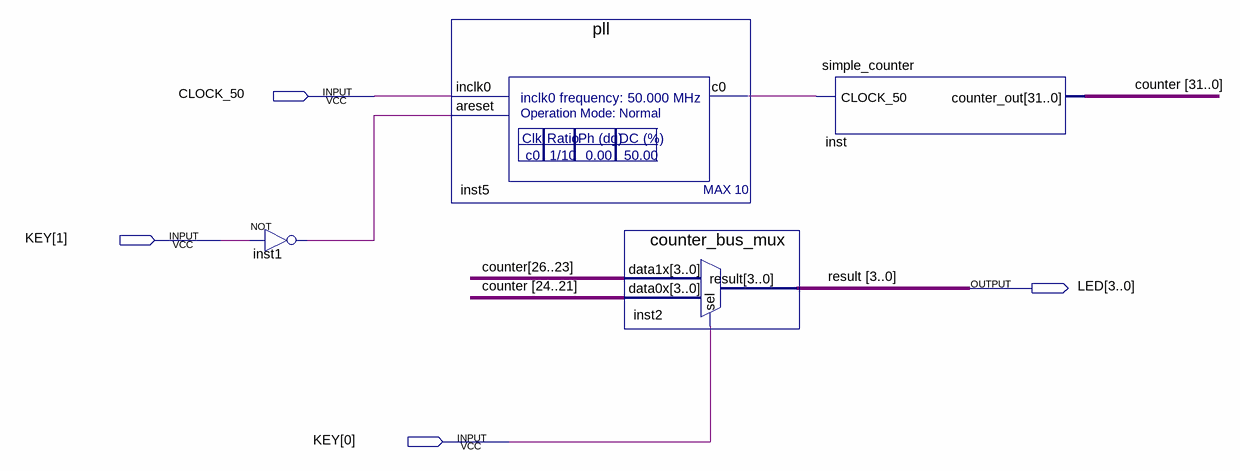
[diagram p0: schematic sheet]
// Quartus schematic my_first_fpga.bdf as structural Verilog: 4 symbols, 4 pins
module my_first_fpga (
  input  CLOCK_50,
  input  [1:0] KEY,
  output [3:0] LED
);

  wire inst1_out, inst5_c0;
  wire [31:0] counter;

  not inst1 (inst1_out, KEY[1]);
  pll inst5 (.inclk0(CLOCK_50), .areset(inst1_out), .c0(inst5_c0));
  counter_bus_mux inst2 (.data1x(counter[26:23]), .data0x(counter[24:21]), .sel(KEY[0]), .result(LED));
  simple_counter inst (.CLOCK_50(inst5_c0), .counter_out(counter));

  // Other names for the same wires on the sheet: result[3:0] = LED
endmodule
